# EAGLE schematic MotoDriver (EAGLE 7.3.0)
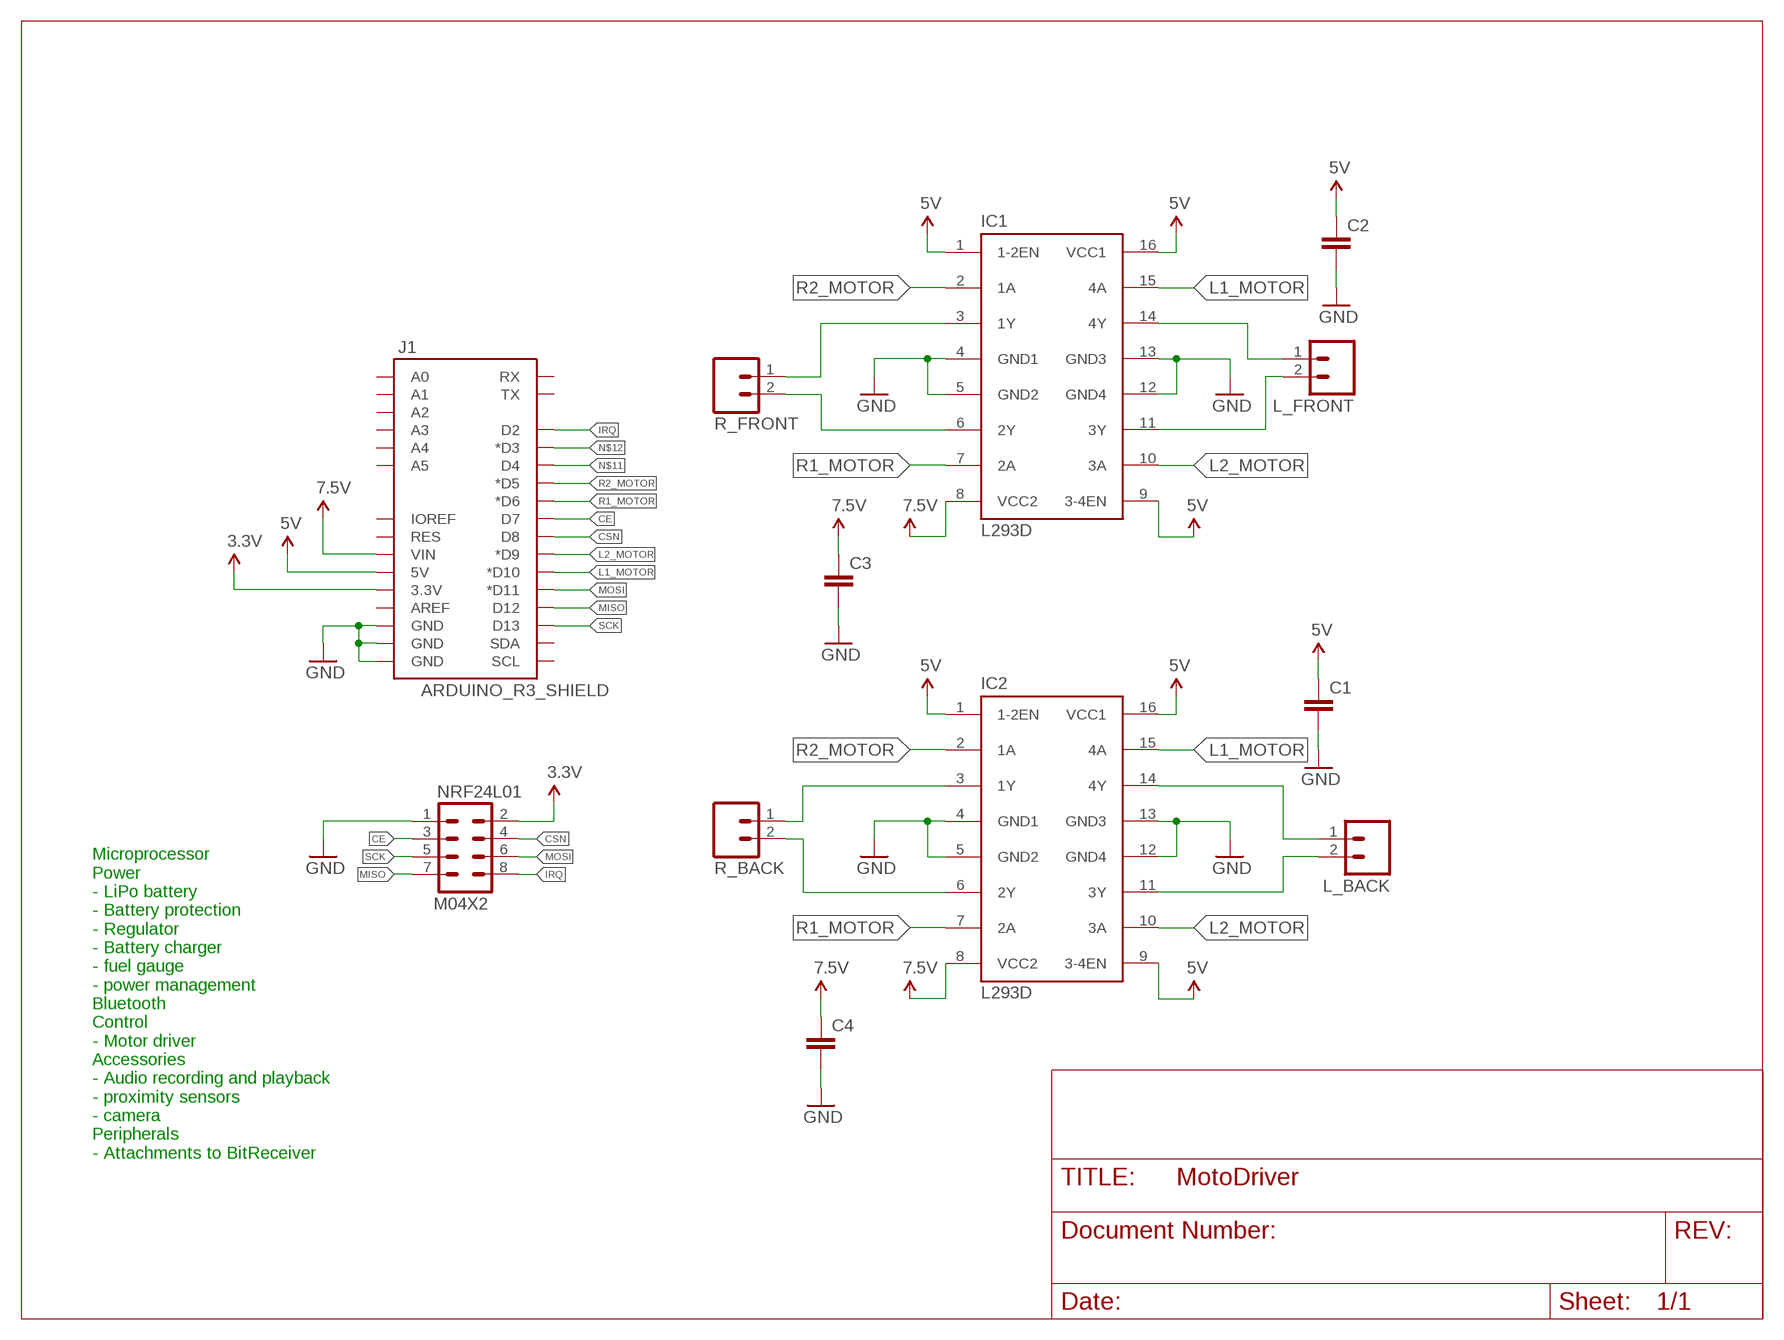
[diagram p0: schematic, sheet 1]

## Parts
C1  C-EU050-024X044  [C050-024X044]
C2  C-EU050-024X044  [C050-024X044]
C3  C-EU050-024X044  [C050-024X044]
C4  C-EU050-024X044  [C050-024X044]
IC1  L293D  [DIL16]
IC2  L293D  [DIL16]
J1  ARDUINO_R3_SHIELD  [UNO_R3_SHIELD]
L_BACK  M021X02_NO_SILK  [1X02_NO_SILK]
L_FRONT  M021X02_NO_SILK  [1X02_NO_SILK]
NRF24L01  M04X2  [2X4]
R_BACK  M021X02_NO_SILK  [1X02_NO_SILK]
R_FRONT  M021X02_NO_SILK  [1X02_NO_SILK]

## Nets
3.3V: J1.3.3V NRF24L01.2
5V: C1.1 C2.1 IC1.1(1-2EN) IC1.9(3-4EN) IC1.16(VCC1) IC2.1(1-2EN) IC2.9(3-4EN) IC2.16(VCC1) J1.5V
CE: J1.D7 NRF24L01.3
CSN: J1.D8 NRF24L01.4
GND: C1.2 C2.2 C3.2 C4.2 IC1.4(GND1) IC1.5(GND2) IC1.12(GND4) IC1.13(GND3) IC2.4(GND1) IC2.5(GND2) IC2.12(GND4) IC2.13(GND3) J1.GND@0(GND) J1.GND@1(GND) J1.GND@2(GND) NRF24L01.1
IRQ: J1.D2 NRF24L01.8
L1_1: IC1.14(4Y) L_FRONT.1
L1_2: IC2.14(4Y) L_BACK.1
L1_MOTOR: IC1.15(4A) IC2.15(4A) J1.D10(*D10)
L2_1: IC1.11(3Y) L_FRONT.2
L2_2: IC2.11(3Y) L_BACK.2
L2_MOTOR: IC1.10(3A) IC2.10(3A) J1.D9(*D9)
MISO: J1.D12 NRF24L01.7
MOSI: J1.D11(*D11) NRF24L01.6
N$11: J1.D4
N$12: J1.D3(*D3)
R1_1: IC1.3(1Y) R_FRONT.1
R1_2: IC2.3(1Y) R_BACK.1
R1_MOTOR: IC1.7(2A) IC2.7(2A) J1.D6(*D6)
R2_1: IC1.6(2Y) R_FRONT.2
R2_2: IC2.6(2Y) R_BACK.2
R2_MOTOR: IC1.2(1A) IC2.2(1A) J1.D5(*D5)
SCK: J1.D13 NRF24L01.5
V_BATT: C3.1 C4.1 IC1.8(VCC2) IC2.8(VCC2) J1.VIN ; supply symbol labelled 7.5V
Unconnected: J1.A0 J1.A1 J1.A2 J1.A3 J1.A4 J1.A5 J1.AREF J1.IOREF J1.RES J1.RX J1.SCL J1.SDA J1.TX

## Notes on the sheet
- Microprocessor
  Power
  - LiPo battery
  - Battery protection
  - Regulator
  - Battery charger
  - fuel gauge
  - power management
  Bluetooth
  Control
  - Motor driver
  Accessories
  - Audio recording and playback
  - proximity sensors
  - camera
  Peripherals
  - Attachments to BitReceiver

## Library data of the parts
C1-C4 = resistor:C-EU: CAPACITOR, European symbol
IC1 IC2 = st-microelectronics:L293D: PUSH-PULL 4 CHANNEL DRIVER; MPN: L293D; OC_FARNELL: 9589619; OC_NEWARK: 56P8249
J1 = SparkFun-Boards:ARDUINO_R3_SHIELD: Shield form compatible with the Arduino Uno R3.
L_BACK L_FRONT R_BACK R_FRONT = SparkFun-Connectors:M02: Standard 2-pin 0.1" header. Use with - straight break away headers ( PRT-00116) - right angle break away headers (PRT-00553) - swiss pins (PRT-00743) - machine pins (PRT-00117) - female headers (PRT-00115) Molex polarized connector foot print use with: PRT-08233 with associated crimp pins and housings. 2.54_SCREWTERM for use with PRT-10571. 3.5mm Screw Terminal footprints for PRT-08084 5mm Screw Terminal footprints for use with PRT-08432
NRF24L01 = SparkFun-Connectors:M04X2: .1" header, two rows of four.